# EasyEDA schematic FFB_Arduino_Yoke_1.2_Micro.json
TITLE: FFB Arduino Yoke; REV: 1.2; Date: 16.01.2023; Sheet: 1/1; Company: Gagagu
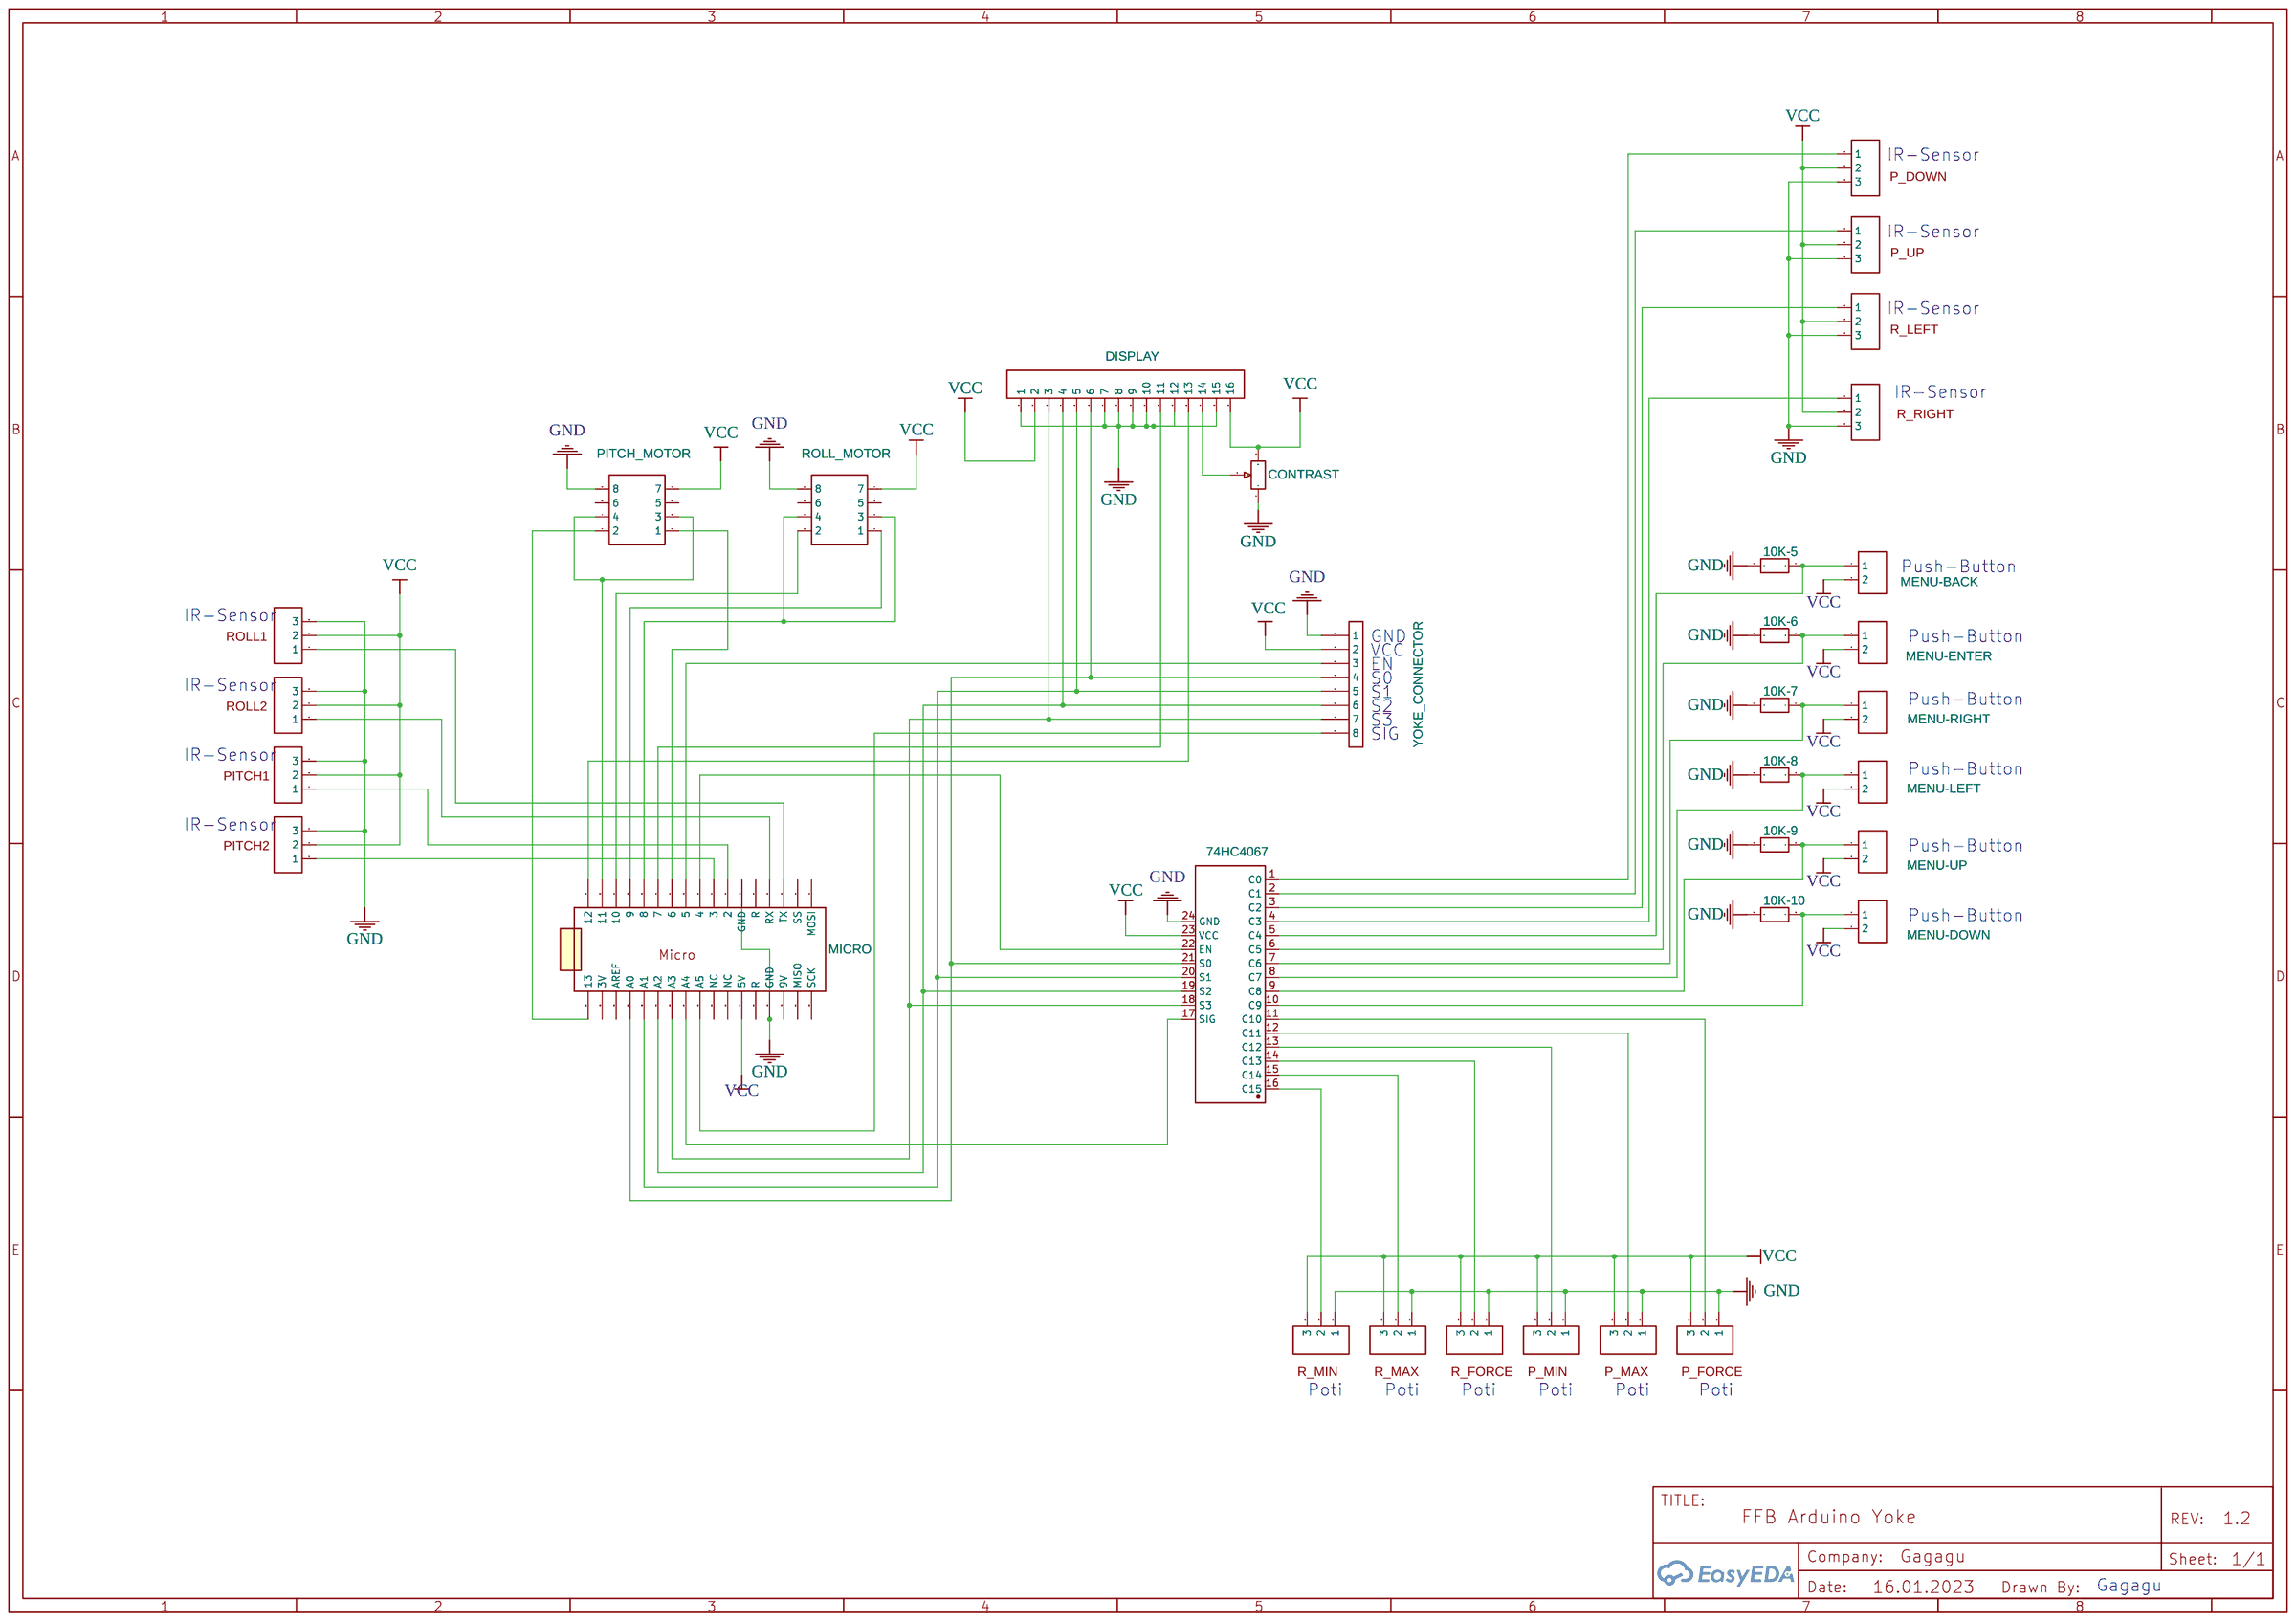
[diagram p0: schematic sheet]

## Parts
10K-5  10k  [R_AXIAL-0.4]
10K-6  10k  [R_AXIAL-0.4]
10K-7  10k  [R_AXIAL-0.4]
10K-8  10k  [R_AXIAL-0.4]
10K-9  10k  [R_AXIAL-0.4]
10K-10  10k  [R_AXIAL-0.4]
74HC4067  MUX CD74HC4067  [16-KANAL ANALOG/DIGITAL MULTIPLEXER MUX CD74HC4067]
CONTRAST  R_3386P_EU  [RES-ADJ-TH_3386P]
DISPLAY  HDR-M-2.54_1x16  [HDR-M-2.54_1X16]
MENU-BACK  HDR-F-2.54_1x2  [HDR-F-2.54_1X2]
MENU-DOWN  HDR-F-2.54_1x2  [HDR-F-2.54_1X2]
MENU-ENTER  HDR-F-2.54_1x2  [HDR-F-2.54_1X2]
MENU-LEFT  HDR-F-2.54_1x2  [HDR-F-2.54_1X2]
MENU-RIGHT  HDR-F-2.54_1x2  [HDR-F-2.54_1X2]
MENU-UP  HDR-F-2.54_1x2  [HDR-F-2.54_1X2]
MICRO  ARDUINOMICRO  [ARDUINOMICRO]
P_DOWN  Multiturn POT 10K  [HDR-F-2.54_1X3]
P_FORCE  Multiturn POT 10K  [HDR-F-2.54_1X3]
P_M;IN  Multiturn POT 10K  [HDR-F-2.54_1X3]
P_MAX  Multiturn POT 10K  [HDR-F-2.54_1X3]
P_UP  Multiturn POT 10K  [HDR-F-2.54_1X3]
PITCH1  Multiturn POT 10K  [HDR-F-2.54_1X3]
PITCH2  Multiturn POT 10K  [HDR-F-2.54_1X3]
PITCH_MOTOR  HDR-F-2.54_2x4  [HDR-F-2.54_2X4]
R_FORCE  Multiturn POT 10K  [HDR-F-2.54_1X3]
R_LEFT  Multiturn POT 10K  [HDR-F-2.54_1X3]
R_MAX  Multiturn POT 10K  [HDR-F-2.54_1X3]
R_MIN  Multiturn POT 10K  [HDR-F-2.54_1X3]
R_RIGHT  Multiturn POT 10K  [HDR-F-2.54_1X3]
ROLL1  Multiturn POT 10K  [HDR-F-2.54_1X3]
ROLL2  Multiturn POT 10K  [HDR-F-2.54_1X3]
ROLL_MOTOR  HDR-F-2.54_2x4  [HDR-F-2.54_2X4]
YOKE_CONNECTOR  Yoke Connector  [DUPONT_1X8]

## Library data of the parts
10K-5-10K-10 = R_AXIAL-0.3_EU: Contributor: LCEDA_Lib
74HC4067 = 16-Kanal Analog/Digital Multiplexer MUX CD74HC4067: Supplier: Bastelgarage; Supplier Part: 420243; link: https://www.bastelgarage.ch/16-kanal-analog-digital-multiplexer-mux-cd74hc4067?search=420243; Contributor: Lemon Six
CONTRAST = R_3386P_EU: Supplier: LCSC; Contributor: LCEDA_Lib; Value(Ω): 10K
DISPLAY = HDR-M-2.54_1x16: Supplier: LCSC; Contributor: LCEDA_Lib
MENU-BACK MENU-DOWN MENU-ENTER MENU-LEFT MENU-RIGHT MENU-UP = HDR-F-2.54_1x2: Supplier Part: C49661; Supplier: LCSC; Contributor: LCEDA_Lib
MICRO = ARDUINOMICRO: Contributor: noobieman21
P_DOWN P_FORCE P_M;IN P_MAX P_UP PITCH1 PITCH2 R_FORCE R_LEFT R_MAX R_MIN R_RIGHT ROLL1 ROLL2 = HDR-F-2.54_1x3: Supplier Part: C146690; Supplier: LCSC; Contributor: Scikraft; Package Display: Yes
PITCH_MOTOR ROLL_MOTOR = HDR-F-2.54_2x4: Supplier Part: C239344; Supplier: LCSC; Contributor: LCEDA_Lib
YOKE_CONNECTOR = DUPONT_1X8: Manufacturer Part: Conector_dupont; Contributor: invenitec

## Nets
GND: 10K-5.1 10K-6.1 10K-7.1 10K-8.1 10K-9.1 10K-10.1 74HC4067.24(GND) CONTRAST.1 DISPLAY.1 DISPLAY.7 DISPLAY.8 DISPLAY.9 DISPLAY.10 DISPLAY.12 DISPLAY.15 MICRO.P$12(GND) MICRO.P$21(GND) P_DOWN.3 P_FORCE.1 P_M;IN.1 P_MAX.1 P_UP.3 PITCH1.3 PITCH2.3 PITCH_MOTOR.8 R_FORCE.1 R_LEFT.3 R_MAX.1 R_MIN.1 R_RIGHT.3 ROLL1.3 ROLL2.3 ROLL_MOTOR.8 YOKE_CONNECTOR.1
VCC: 74HC4067.23(VCC) CONTRAST.3 DISPLAY.2 DISPLAY.16 MENU-BACK.2 MENU-DOWN.2 MENU-ENTER.2 MENU-LEFT.2 MENU-RIGHT.2 MENU-UP.2 MICRO.P$23(5V) P_DOWN.2 P_FORCE.3 P_M;IN.3 P_MAX.3 P_UP.2 PITCH1.2 PITCH2.2 PITCH_MOTOR.7 R_FORCE.3 R_LEFT.2 R_MAX.3 R_MIN.3 R_RIGHT.2 ROLL1.2 ROLL2.2 ROLL_MOTOR.7 YOKE_CONNECTOR.2
Net-(10K-5-2): 10K-5.2 74HC4067.5(C4) MENU-BACK.1
Net-(10K-6-2): 10K-6.2 74HC4067.6(C5) MENU-ENTER.1
Net-(10K-7-2): 10K-7.2 74HC4067.7(C6) MENU-RIGHT.1
Net-(10K-8-2): 10K-8.2 74HC4067.8(C7) MENU-LEFT.1
Net-(10K-9-2): 10K-9.2 74HC4067.9(C8) MENU-UP.1
Net-(10K-10-2): 10K-10.2 74HC4067.10(C9) MENU-DOWN.1
Net-(74HC4067-1): 74HC4067.1(C0) P_DOWN.1
Net-(74HC4067-2): 74HC4067.2(C1) P_UP.1
Net-(74HC4067-3): 74HC4067.3(C2) R_LEFT.1
Net-(74HC4067-4): 74HC4067.4(C3) R_RIGHT.1
Net-(74HC4067-11): 74HC4067.11(C10) P_FORCE.2
Net-(74HC4067-12): 74HC4067.12(C11) P_MAX.2
Net-(74HC4067-13): 74HC4067.13(C12) P_M;IN.2
Net-(74HC4067-14): 74HC4067.14(C13) R_FORCE.2
Net-(74HC4067-15): 74HC4067.15(C14) R_MAX.2
Net-(74HC4067-16): 74HC4067.16(C15) R_MIN.2
Net-(74HC4067-17): 74HC4067.17(SIG) MICRO.P$27(A4)
Net-(74HC4067-18): 74HC4067.18(S3) DISPLAY.3 MICRO.P$28(A3) YOKE_CONNECTOR.7
Net-(74HC4067-19): 74HC4067.19(S2) DISPLAY.4 MICRO.P$29(A2) YOKE_CONNECTOR.6
Net-(74HC4067-20): 74HC4067.20(S1) DISPLAY.5 MICRO.P$30(A1) YOKE_CONNECTOR.5
Net-(74HC4067-21): 74HC4067.21(S0) DISPLAY.6 MICRO.P$31(A0) YOKE_CONNECTOR.4
Net-(74HC4067-22): 74HC4067.22(EN) MICRO.P$9(4)
Net-(CONTRAST-2): CONTRAST.2 DISPLAY.14
Net-(DISPLAY-11): DISPLAY.11 MICRO.P$6(7)
Net-(DISPLAY-13): DISPLAY.13 MICRO.P$1(12)
Net-(MICRO-P$2): MICRO.P$2(11) PITCH_MOTOR.3 PITCH_MOTOR.4
Net-(MICRO-P$3): MICRO.P$3(10) ROLL_MOTOR.2
Net-(MICRO-P$4): MICRO.P$4(9) ROLL_MOTOR.1
Net-(MICRO-P$5): MICRO.P$5(8) ROLL_MOTOR.3 ROLL_MOTOR.4
Net-(MICRO-P$7): MICRO.P$7(6) PITCH_MOTOR.1
Net-(MICRO-P$8): MICRO.P$8(5) YOKE_CONNECTOR.3
Net-(MICRO-P$10): MICRO.P$10(3) PITCH2.1
Net-(MICRO-P$11): MICRO.P$11(2) PITCH1.1
Net-(MICRO-P$14): MICRO.P$14(RX) ROLL2.1
Net-(MICRO-P$15): MICRO.P$15(TX) ROLL1.1
Net-(MICRO-P$26): MICRO.P$26(A5) YOKE_CONNECTOR.8
Net-(MICRO-P$34): MICRO.P$34(13) PITCH_MOTOR.2

Not connected (* = marked no-connect by the designer): MICRO P$13(R) P$16(SS) P$17(MOSI) P$18(SCK) P$19(MISO) P$20(9V) P$22(R) P$24(NC) P$25(NC) P$32(AREF) P$33(3V); PITCH_MOTOR 5 6; ROLL_MOTOR 5 6

## Notes on the sheet
- IR-Sensor
- IR-Sensor
- IR-Sensor
- IR-Sensor
- Push-Button
- IR-Sensor
- GND
- Push-Button
- EN
- VCC
- S0
- IR-Sensor
- S1
- S2
- Push-Button
- S3
- SIG
- IR-Sensor
- Push-Button
- IR-Sensor
- Push-Button
- Push-Button
- Poti
- Poti
- Poti
- Poti
- Poti
- Poti
- Gagagu
